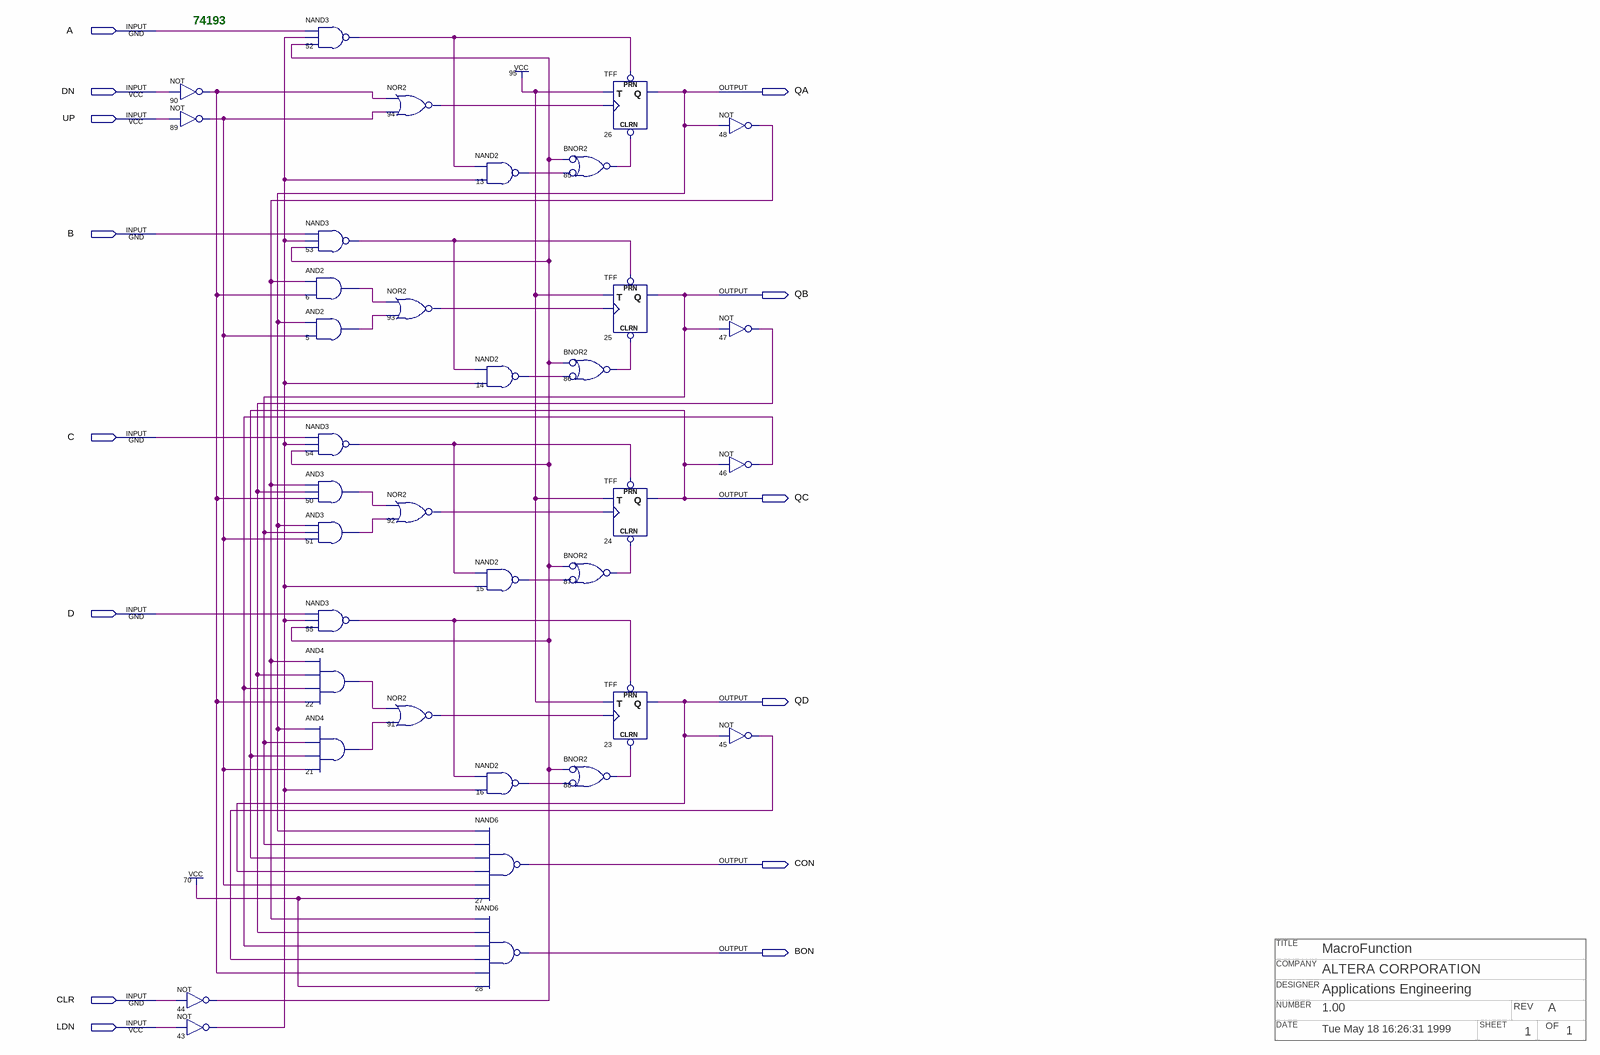
[diagram p0: schematic sheet]
// Quartus schematic 74193.bdf as structural Verilog: 36 symbols, 14 pins
// Title block: TITLE: MacroFunction; COMPANY: ALTERA CORPORATION; DESIGNER: Applications Engineering; NUMBER: 1.00; REV: A; DATE: Tue May 18 16:26:31 1999; SHEET: 1; OF: 1
module \74193  (
  input  A,
  input  DN,
  input  UP,
  input  B,
  input  C,
  input  D,
  input  CLR,
  input  LDN,
  output QA,
  output QB,
  output QC,
  output QD,
  output CON,
  output BON
);

  wire n5_out, n6_out, n13_out, n14_out, n15_out, n16_out, n21_out, n22_out, n43_out, n44_out, n45_out,
       n46_out, n47_out, n48_out, n50_out, n51_out, n52_out, n53_out, n54_out, n55_out, n85_out, n86_out,
       n87_out, n88_out, n89_out, n90_out, n91_out, n92_out, n93_out, n94_out;

  not u_90 (n90_out, DN);
  not u_89 (n89_out, UP);
  not u_44 (n44_out, CLR);
  not u_43 (n43_out, LDN);
  nand u_52 (n52_out, A, n43_out, n44_out);
  nand u_53 (n53_out, B, n43_out, n44_out);
  and u_6 (n6_out, n48_out, n90_out);
  and u_5 (n5_out, QA, n89_out);
  nand u_54 (n54_out, C, n43_out, n44_out);
  and u_50 (n50_out, n48_out, n47_out, n90_out);
  and u_51 (n51_out, QA, QB, n89_out);
  nand u_55 (n55_out, D, n43_out, n44_out);
  and u_22 (n22_out, n48_out, n47_out, n46_out, n90_out);
  and u_21 (n21_out, QA, QB, QC, n89_out);
  nor u_94 (n94_out, n90_out, n89_out);
  nor u_93 (n93_out, n6_out, n5_out);
  nor u_92 (n92_out, n50_out, n51_out);
  nor u_91 (n91_out, n22_out, n21_out);
  nand u_13 (n13_out, n52_out, n43_out);
  nand u_14 (n14_out, n53_out, n43_out);
  nand u_15 (n15_out, n54_out, n43_out);
  nand u_16 (n16_out, n55_out, n43_out);
  nand u_27 (CON, QA, QB, QC, QD, n89_out, 1'b1);
  nand u_28 (BON, n48_out, n47_out, n46_out, n45_out, n90_out, 1'b1);
  nor u_85 (n85_out, ~n44_out, ~n13_out);  // BNOR2
  nor u_86 (n86_out, ~n44_out, ~n14_out);  // BNOR2
  nor u_87 (n87_out, ~n44_out, ~n15_out);  // BNOR2
  nor u_88 (n88_out, ~n44_out, ~n16_out);  // BNOR2
  TFF u_26 (.PRN(n52_out), .CLRN(n85_out), .T(1'b1), .CLK(n94_out), .Q(QA));
  TFF u_25 (.PRN(n53_out), .CLRN(n86_out), .T(1'b1), .CLK(n93_out), .Q(QB));
  TFF u_24 (.PRN(n54_out), .CLRN(n87_out), .T(1'b1), .CLK(n92_out), .Q(QC));
  TFF u_23 (.PRN(n55_out), .CLRN(n88_out), .T(1'b1), .CLK(n91_out), .Q(QD));
  not u_48 (n48_out, QA);
  not u_47 (n47_out, QB);
  not u_46 (n46_out, QC);
  not u_45 (n45_out, QD);

  // Notes on the sheet:
  //   74193
endmodule
